# EAGLE design rapidshark-forward-breakout-mk-1.2 (EAGLE 7.5.0)
AUTHOR: sean@yak.net
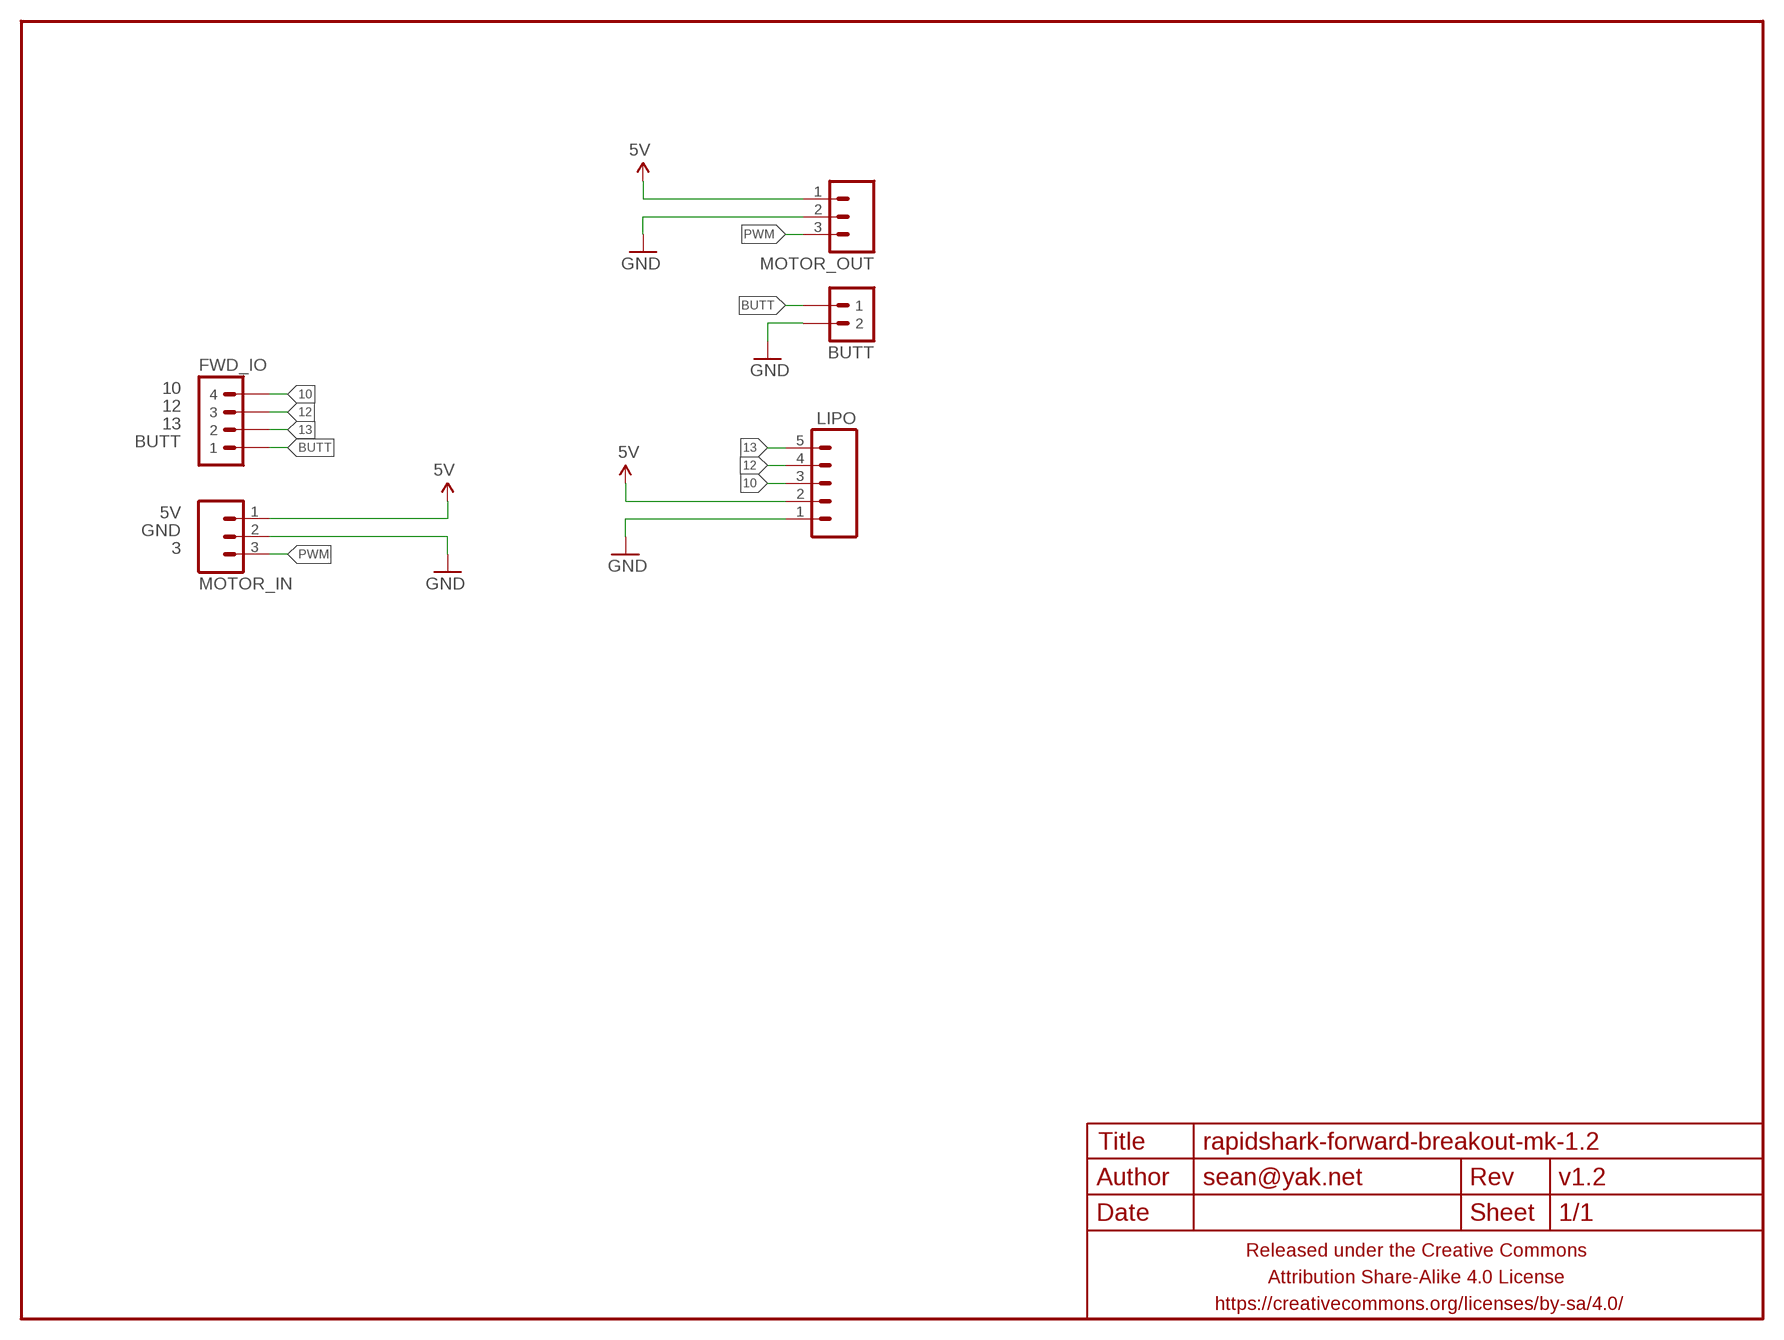
[diagram p0: schematic, sheet 1]

## Parts
BUTT  M02JST-PTH-VERT  [JST-2-PH-VERT-PTH]
FRAME1  FRAME-LETTERNO_PACKAGE  [DUMMY]
FWD_IO  M04JST-PTH-VERT  [JST-4-PH-VERT-PTH]
LIPO  M05JST-PH-VERT-PTH  [JST-5-PH-VERT-PTH]
MOTOR_IN  M03JST-PTH-VERT  [JST-3-PH-VERT-PTH]
MOTOR_OUT  M03JST-PTH-VERT  [JST-3-PH-VERT-PTH]

## Nets
5V: LIPO.2 MOTOR_IN.1 MOTOR_OUT.1
10: FWD_IO.4 LIPO.3
12: FWD_IO.3 LIPO.4
13: FWD_IO.2 LIPO.5
BUTT: BUTT.1 FWD_IO.1
GND: BUTT.2 LIPO.1 MOTOR_IN.2 MOTOR_OUT.2
PWM: MOTOR_IN.3 MOTOR_OUT.3

## Notes on the sheet
- 10
- 12
- 13
- BUTT
- 5V
- GND
- 3

## Library data of the parts
BUTT = a_parts:M02: Standard 2-pin 0.1" header. Use with - straight break away headers ( PRT-00116) - right angle break away headers (PRT-00553) - swiss pins (PRT-00743) - machine pins (PRT-00117) - female headers (PRT-00115) Molex polarized connector foot print use with: PRT-08233 with associated crimp pins and housings. 2.54_SCREWTERM for use with PRT-10571. 3.5mm Screw Terminal footprints for PRT-08084 5mm Screw Terminal footprints for use with PRT-08433
FRAME1 = a_parts:FRAME-LETTER: Schematic Frame Standard 8.5x11 US Letter frame; DESIGNER: sean@yak.net; VERSION: v1.2
FWD_IO = a_parts:M04: Header 4 Standard 4-pin 0.1" header. Use with straight break away headers (SKU : PRT-00116), right angle break away headers (PRT-00553), swiss pins (PRT-00743), machine pins (PRT-00117), and female headers (PRT-00115). Molex polarized connector foot print use with SKU : PRT-08231 with associated crimp pins and housings. 1MM SMD Version SKU: PRT-10208
LIPO = a_parts:M05: Header 5 Standard 5-pin 0.1" header. Use with straight break away headers (SKU : PRT-00116), right angle break away headers (PRT-00553), swiss pins (PRT-00743), machine pins (PRT-00117), and female headers (PRT-00115). Molex polarized connector foot print use with SKU : PRT-08230 with associated crimp pins and housings.
MOTOR_IN MOTOR_OUT = a_parts:M03: Header 3 Standard 3-pin 0.1" header. Use with straight break away headers (SKU : PRT-00116), right angle break away headers (PRT-00553), swiss pins (PRT-00743), machine pins (PRT-00117), and female headers (PRT-00115). Molex polarized connector foot print use with SKU : PRT-08232 with associated crimp pins and housings.

## Board
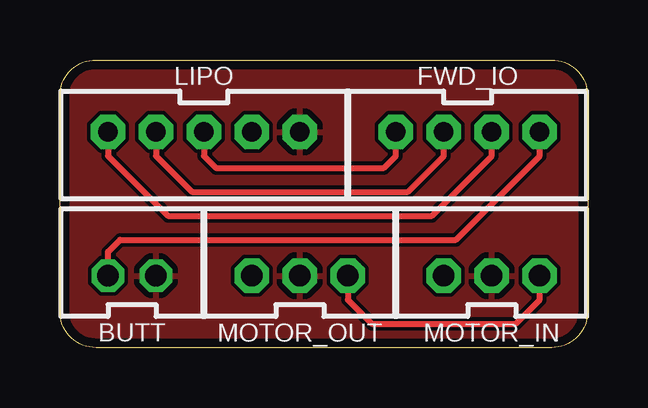
[diagram p1: board, top side]
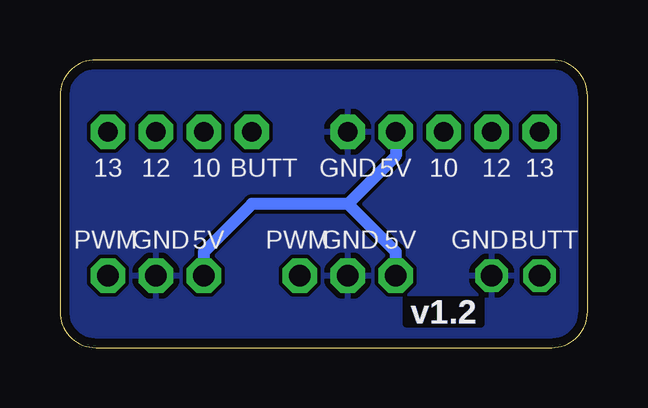
[diagram p2: board, bottom side, seen from below]

Size 22 x 12 mm. Coordinates in mm from the lower left corner, seen from the top.
Outline: 1.5,12 20.5,12 arc-90 22,10.5 22,1.5 arc-90 20.5,0 1.5,0 arc-90 0,1.5 0,10.5 arc-90 1.5,12
Copper layers (1*16): Top 0.0356mm / dielectric 1.5011mm / Bottom 0.0356mm
Design rules "LaenPCBOrder_2": minimum track width 6mil, minimum drill 13mil, track to track 6mil, track to pad 6mil, pad to pad 6mil, via to via 6mil, smd to smd 6mil, copper to edge 15mil, drill to drill 6mil, minimum pad ring 7mil, minimum via ring 7mil, stop-mask expansion 3mil, vias tented up to drill 20mil, thermal gap 10mil

### Footprints (pad centres in the part's own frame; a part is rotated, then mirrored left to right if it is on the bottom)
JST-2-PH-VERT-PTH = drill 0.9 octagon: 1 -1,0; 2 1,0
JST-4-PH-VERT-PTH = drill 0.8 pad 1.422 octagon: 1 0,0; 2 2,0; 3 4,0; 4 6,0
JST-5-PH-VERT-PTH = drill 0.8 pad 1.422 octagon: 1 -4,0; 2 -2,0; 3 0,0; 4 2,0; 5 4,0
JST-3-PH-VERT-PTH = drill 0.9 pad 1.422 octagon: 1 0,0; 2 2,0; 3 4,0

### Placement (x,y rotation side)
BUTT  3,3 0 top
FRAME1  0,0 270 bottom
FWD_IO  20,9 180 top
LIPO  6,9 180 top
MOTOR_IN  16,3 0 top
MOTOR_OUT  8,3 0 top

### Tracks (layer width: path | path; a pad name or v marks a point on that pad's centre or on a via)
5V
  Bottom 0.5: MOTOR_OUT.1 8,4 10,6 | LIPO.2 8,8 10,6 | 10,6 14,6 16,4 MOTOR_IN.1
10
  Top 0.254: LIPO.3 6,8 6.5,7.5 13.5,7.5 14,8 FWD_IO.4
12
  Top 0.254: LIPO.4 4,8 5.5,6.5 14.5,6.5 16,8 FWD_IO.3
13
  Top 0.254: LIPO.5 2,8 4.5,5.5 15.5,5.5 18,8 FWD_IO.2
BUTT
  Top 0.254: BUTT.1 2,4 2.5,4.5 16.5,4.5 20,8 FWD_IO.1
GND
  pour Top (rank 6): 1.5,12 20.5,12 arc-90 22,10.5 22,1.5 arc-90 20.5,0 1.5,0 arc-90 0,1.5 0,10.5 arc-90
  pour Bottom (rank 6): 1.5,12 20.5,12 arc-90 22,10.5 22,1.5 arc-90 20.5,0 1.5,0 arc-90 0,1.5 0,10.5 arc-90
PWM
  Top 0.254: MOTOR_OUT.3 12,2 13,1 19,1 20,2 MOTOR_IN.3

### Text on the board
bPlace: 13 | 12 | 10 | 5V | GND | BUTT | 10 | 12 | 13 | BUTT | GND | 5V | GND | PWM | 5V | GND | PWM